# EAGLE schematic main_board (EAGLE 5.11)
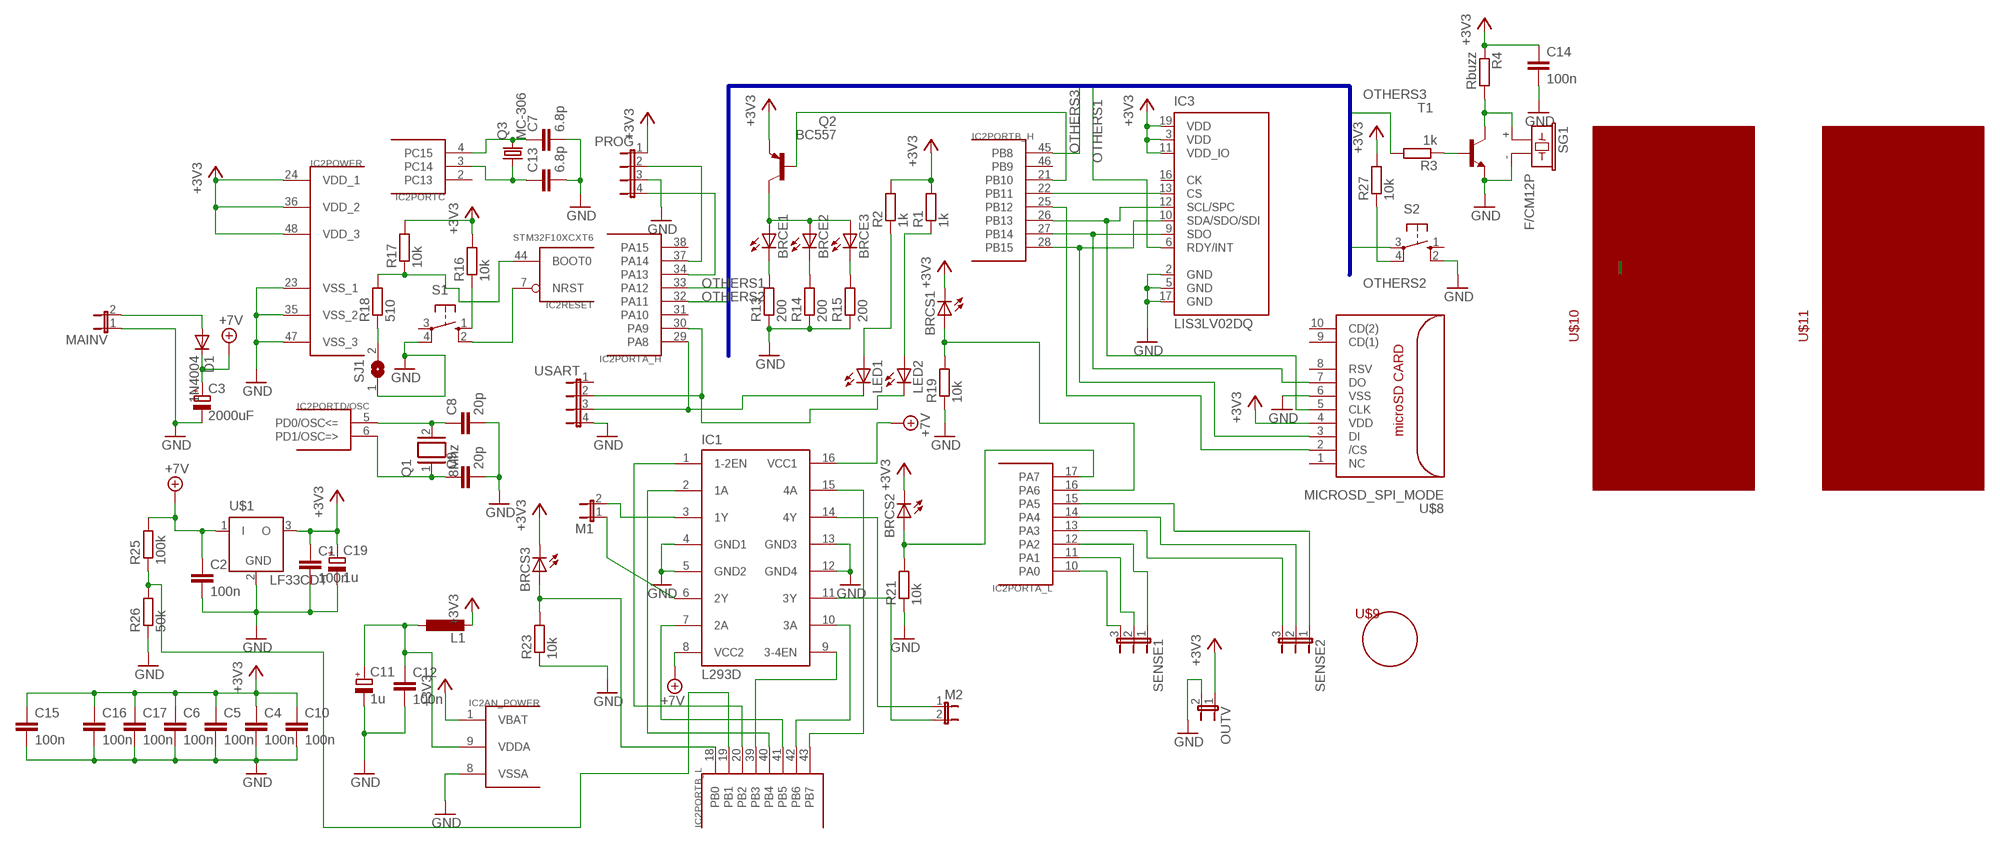
[diagram p0: schematic, sheet 1]

## Parts
BRCE1  LED5MM  [LED5MM]
BRCE2  LED5MM  [LED5MM]
BRCE3  LED5MM  [LED5MM]
BRCS1  LED5MM  [LED5MM]
BRCS2  LED5MM  [LED5MM]
BRCS3  LED5MM  [LED5MM]
C1  100n  C-EUC1206  [C1206]
C2  100n  C-EUC1206  [C1206]
C3  2000uF  CPOL-EUE3.5-10  [E3,5-10]
C4  100n  C-EUC1206  [C1206]
C5  100n  C-EUC1206  [C1206]
C6  100n  C-EUC1206  [C1206]
C7  6.8p  C-EUC1206  [C1206]
C8  20p  C-EUC1206  [C1206]
C9  20p  C-EUC1206  [C1206]
C10  100n  C-EUC1206  [C1206]
C11  1u  CPOL-EUB  [PANASONIC_B]
C12  100n  C-EUC1206  [C1206]
C13  6.8p  C-EUC1206  [C1206]
C14  100n  C-EUC1206  [C1206]
C15  100n  C-EUC1206  [C1206]
C16  100n  C-EUC1206  [C1206]
C17  100n  C-EUC1206  [C1206]
C19  1u  CPOL-EUB  [PANASONIC_B]
D1  1N4004  [DO41-10]
IC1  L293D  [DIL16]
IC2  STM32F10XCXT6  [TQFP48]
IC3  LIS3LV02DQ  [QFPN-28]
L1  L-EUL3230M  [L3230M]
LED1  LEDCHIPLED_1206  [CHIPLED_1206]
LED2  LEDCHIPLED_1206  [CHIPLED_1206]
M1  JP1E  [JP1]
M2  JP1E  [JP1]
MAINV  JP1E  [JP1]
OUTV  JP1E  [JP1]
PROG  JP4E  [JP4]
Q1  8Mhz  XTAL/S  [QS]
Q2  BC557  [TO92]
Q3  MC-306  [MC-306]
R1  1k  R-EU_M1206  [M1206]
R2  1k  R-EU_M1206  [M1206]
R3  1k  R-EU_M1206  [M1206]
R4  Rbuzz  R-EU_M1206  [M1206]
R13  200  R-EU_M1206  [M1206]
R14  200  R-EU_M1206  [M1206]
R15  200  R-EU_M1206  [M1206]
R16  10k  R-EU_M1206  [M1206]
R17  10k  R-EU_M1206  [M1206]
R18  510  R-EU_M1206  [M1206]
R19  10k  R-EU_M1206  [M1206]
R21  10k  R-EU_M1206  [M1206]
R23  10k  R-EU_M1206  [M1206]
R25  100k  R-EU_M1206  [M1206]
R26  50k  R-EU_M1206  [M1206]
R27  10k  R-EU_M1206  [M1206]
S1  10-XX  [B3F-10XX]
S2  10-XX  [B3F-10XX]
SENSE1  JP2E  [JP2]
SENSE2  JP2E  [JP2]
SG1  F/CM12P  [F/CM12P]
SJ1  SJW  [SJW]
T1  BC547B-NPN-TO92-CBE  [TO92-CBE]
U$1  LF33CDT  [DPAK]
U$8  MICROSD_SPI_MODE  [MICRO_SD_CONNECTOR]
U$9  POLOLU952  [BALLB]
U$10  POLOLU0993B  [MOTORB]
U$11  POLOLU0993B  [MOTORB]
USART  JP4E  [JP4]

## Nets
+3V3: BRCS1.K(C) BRCS2.K(C) BRCS3.K(C) C1.1 C4.1 C5.1 C6.1 C10.1 C14.1 C15.1 C16.1 C17.1 C19.+ IC2.1(AN_POWER:VBAT) IC2.24(POWER:VDD_1) IC2.36(POWER:VDD_2) IC2.48(POWER:VDD_3) IC3.3(VDD) IC3.11(VDD_IO) IC3.19(VDD) L1.2 OUTV.1 PROG.1 Q2.1(E) R1.2 R2.2 R4.1 R16.2 R17.2 R27.2 U$1.3(O) U$8.4(VDD)
+7V: C2.1 C3.+ D1.C IC1.8(VCC2) IC1.16(VCC1) R25.2 U$1.1(I)
GND: C1.2 C2.2 C3.- C4.2 C5.2 C6.2 C7.2 C8.2 C9.2 C10.2 C11.- C12.2 C13.2 C14.2 C15.2 C16.2 C17.2 C19.- IC1.4(GND1) IC1.5(GND2) IC1.12(GND4) IC1.13(GND3) IC2.8(AN_POWER:VSSA) IC2.23(POWER:VSS_1) IC2.35(POWER:VSS_2) IC2.47(POWER:VSS_3) IC3.2(GND) IC3.5(GND) IC3.17(GND) MAINV.1 OUTV.2 PROG.3 R13.1 R14.1 R15.1 R19.1 R21.1 R23.1 R26.1 S1.4(P1) S2.2(S1) SG1.- SJ1.1 T1.E U$1.2(GND) U$8.6(VSS) USART.4
N$1: IC1.2(1A) IC2.40(PORTB_L:PB4)
N$2: IC1.7(2A) IC2.41(PORTB_L:PB5)
N$3: IC1.10(3A) IC2.42(PORTB_L:PB6)
N$4: IC1.15(4A) IC2.43(PORTB_L:PB7)
N$5: C9.1 IC2.6(PORTD/OSC:PD1/OSC=>) Q1.1
N$6: C8.1 IC2.5(PORTD/OSC:PD0/OSC<=) Q1.2
N$7: IC1.1(1-2EN) IC2.20(PORTB_L:PB2)
N$8: IC1.9(3-4EN) IC2.39(PORTB_L:PB3)
N$9: R3.1 T1.B
N$10: R4.2 SG1.+ T1.C
N$11: LED1.A R2.1
N$12: LED2.A R1.1
N$13: IC2.37(PORTA_H:PA14) PROG.2
N$15: IC2.11(PORTA_L:PA1) SENSE1.2
N$16: IC2.12(PORTA_L:PA2) SENSE1.1
N$17: IC2.13(PORTA_L:PA3) SENSE2.3
N$18: IC2.14(PORTA_L:PA4) SENSE2.2
N$19: IC2.15(PORTA_L:PA5) SENSE2.1
N$20: IC2.34(PORTA_H:PA13) PROG.4
N$21: C11.+ C12.1 IC2.9(AN_POWER:VDDA) L1.1
N$22: IC2.10(PORTA_L:PA0) SENSE1.3
N$27: IC2.21(PORTB_H:PB10) Q2.2(B)
N$28: BRCE1.K(C) R13.2
N$29: BRCE2.K(C) R14.2
N$30: BRCE3.K(C) R15.2
N$31: BRCE1.A BRCE2.A BRCE3.A Q2.3(C)
N$32: IC2.26(PORTB_H:PB13) IC3.12(SCL/SPC) U$8.5(CLK)
N$33: IC2.27(PORTB_H:PB14) IC3.9(SDO) U$8.7(DO)
N$34: IC2.22(PORTB_H:PB11) IC3.13(CS)
N$35: C13.1 IC2.3(PORTC:PC14) Q3.1
N$36: IC2.25(PORTB_H:PB12) U$8.2(/CS)
N$37: IC2.28(PORTB_H:PB15) IC3.10(SDA/SDO/SDI) U$8.3(DI)
N$38: C7.1 IC2.4(PORTC:PC15) Q3.4
N$39: IC2.7(RESET:NRST) S1.2(S1)
N$40: R16.1 S1.1(S)
N$41: IC2.44(RESET:BOOT0) R17.1 R18.2
N$42: R18.1 SJ1.2
N$43: D1.A MAINV.2
N$44: BRCS1.A IC2.16(PORTA_L:PA6) R19.2
N$46: BRCS2.A IC2.17(PORTA_L:PA7) R21.2
N$47: BRCS3.A IC2.18(PORTB_L:PB0) R23.2
N$49: IC2.19(PORTB_L:PB1) R25.1 R26.2
N$50: IC2.30(PORTA_H:PA9) LED2.C USART.2
N$51: IC2.29(PORTA_H:PA8) LED1.C USART.3
N$52: R27.1 S2.4(P1)
N$53: IC1.3(1Y) M1.2
N$54: IC1.6(2Y) M1.1
N$55: IC1.14(4Y) M2.1
N$56: IC1.11(3Y) M2.2
OTHERS1: IC2.33(PORTA_H:PA12) IC3.6(RDY/INT)
OTHERS2: IC2.32(PORTA_H:PA11) S2.3(P)
OTHERS3: IC2.45(PORTB_H:PB8) R3.2
Unconnected: IC2.2(PORTC:PC13) IC2.31(PORTA_H:PA10) IC2.38(PORTA_H:PA15) IC2.46(PORTB_H:PB9) IC3.16(CK) S1.3(P) S2.1(S) U$8.1(NC) U$8.8(RSV) U$8.9(CD(1)) U$8.10(CD(2)) USART.1

## Buses
OTHERS[1..10]

## Library data of the parts
BRCE1-BRCE3 BRCS1-BRCS3 LED1 LED2 = led:LED: LED OSRAM: - CHIPLED LG R971, LG N971, LY N971, LG Q971, LY Q971, LO R971, LY R971 LH N974, LH R974 LS Q976, LO Q976, LY Q976 LO Q996 - Hyper CHIPLED LW Q18S LB Q993, LB Q99A, LB R99A - SideLED LS A670, LO A670, LY A670, LG A670, LP A670 LB A673, LV A673, LT A673, LW A673 LH A674 LY A675 LS A676, LA A676, LO A676, LY A676, LW A676 LS A679, LY A679, LG A679 - Hyper Micro SIDELED® LS Y876, LA Y876, LO Y876, LY Y876 LT Y87S - SmartLED LW L88C, LW L88S LB L89C, LB L89S, LG L890 LS L89K, LO L89K, LY L89K LS L896, LA L896, LO L896, LY L896 - TOPLED LS T670, LO T670, LY T670, LG T670, LP T670 LSG T670, LSP T670, LSY T670, LOP T670, LYG T670 LG T671, LOG T671, LSG T671 LB T673, LV T673, LT T673, LW T673 LH T674 LS T676, LA T676, LO T676, LY T676, LB T676, LH T676, LSB T676, LW T676 LB T67C, LV T67C, LT T67C, LS T67K, LO T67K, LY T67K, LW E67C LS E67B, LA E67B, LO E67B, LY E67B, LB E67C, LV E67C, LT E67C LW T67C LS T679, LY T679, LG T679 LS T770, LO T770, LY T770, LG T770, LP T770 LB T773, LV T773, LT T773, LW T773 LH T774 LS E675, LA E675, LY E675, LS T675 LS T776, LA T776, LO T776, LY T776, LB T776 LHGB T686 LT T68C, LB T68C - Hyper Mini TOPLED® LB M676 - Mini TOPLED Santana® LG M470 LS M47K, LO M47K, LY M47K Source: http://www.osram.convergy.de LUXEON: - LUMILED® LXK2-PW12-R00, LXK2-PW12-S00, LXK2-PW14-U00, LXK2-PW14-V00 LXK2-PM12-R00, LXK2-PM12-S00, LXK2-PM14-U00 LXK2-PE12-Q00, LXK2-PE12-R00, LXK2-PE12-S00, LXK2-PE14-T00, LXK2-PE14-U00 LXK2-PB12-K00, LXK2-PB12-L00, LXK2-PB12-M00, LXK2-PB14-N00, LXK2-PB14-P00, LXK2-PB14-Q00 LXK2-PR12-L00, LXK2-PR12-M00, LXK2-PR14-Q00, LXK2-PR14-R00 LXK2-PD12-Q00, LXK2-PD12-R00, LXK2-PD12-S00 LXK2-PH12-R00, LXK2-PH12-S00 LXK2-PL12-P00, LXK2-PL12-Q00, LXK2-PL12-R00 Source: www.luxeon.com KINGBRIGHT: KA-3528ASYC Source: www.kingbright.com
C1 C2 C4-C10 C12-C17 = rcl:C-EU: CAPACITOR, European symbol
C3 C11 C19 = rcl:CPOL-EU: POLARIZED CAPACITOR, European symbol
D1 = diode:1N4004: DIODE general purpose rectifier, 1 A
IC1 = st-microelectronics:L293D: PUSH-PULL 4 CHANNEL DRIVER; MPN: L293D; OC_FARNELL: 9589619; OC_NEWARK: 56P8249
IC2 = stm32:STM32F10XCXT6: ST STM32F101/103 48pin LQFP
IC3 = st-microelectronics:LIS3LV02DQ: MEMS INERTIAL SENSOR 3-Axis - ±2g/±6g Digital Output Low Voltage Linear Accelerometer Source: http://www.st.com/stonline/products/literature/ds/11115/lis3lv02dq.pdf; MF: Arrow Electronics; MPN: LIS3LV02DQ; OC_FARNELL: 1220909; OC_NEWARK: 89K0642
L1 = rcl:L-EU: INDUCTOR, European symbol
M1 M2 MAINV OUTV = jumper:JP1E: JUMPER
PROG USART = jumper:JP4E: JUMPER
Q1 = special:XTAL/S: CRYSTAL
Q2 = transistor-pnp:BC557: PNP Transistor
Q3 = crystal:MC-306: kHz RANGE CRYSTAL UNIT SMD Source: MC-306_405_406_E07X.PDF Homepage <www.epsontoyocom.co.jp>; MPN: MC-306 60.0KHZ 100PPM ,12.5PF; OC_FARNELL: 1278040; OC_NEWARK: 31M5576
R1-R4 R13-R19 R21 R23 R25-R27 = resistor:R-EU_: RESISTOR, European symbol
S1 S2 = switch-omron:10-XX: OMRON SWITCH; MPN: B3F-1000; OC_FARNELL: 176432; OC_NEWARK: 36M3542
SENSE1 SENSE2 = jumper:JP2E: JUMPER
SG1 = buzzer:F/CM12P: BUZZER Source: Buerklin; OC_FARNELL: unknown; OC_NEWARK: unknown
SJ1 = jumper:SJ: SMD solder JUMPER
T1 = transistor:*-NPN-: NPN Transistror BF959 corrected 2008.03.06
U$1 = robot:LF33CDT
U$8 = con-molex-microsd:MICROSD_SPI_MODE: MOLEX - 49225-0821 - CONNECTEUR MICRO SD PUSH/PUSH REV Fabricant: MOLEX Code commande Farnell: 1366700 <http://fr.farnell.com/molex/49225-0821/connecteur-micro-sd-push-push-rev/dp/1366700?Ntt=1366700> Référence fabricant: 49225-0821
U$9 = robot:POLOLU952
U$10 U$11 = robot:POLOLU0993B